# Altium schematic sheet TMC2208.SchDoc
size B
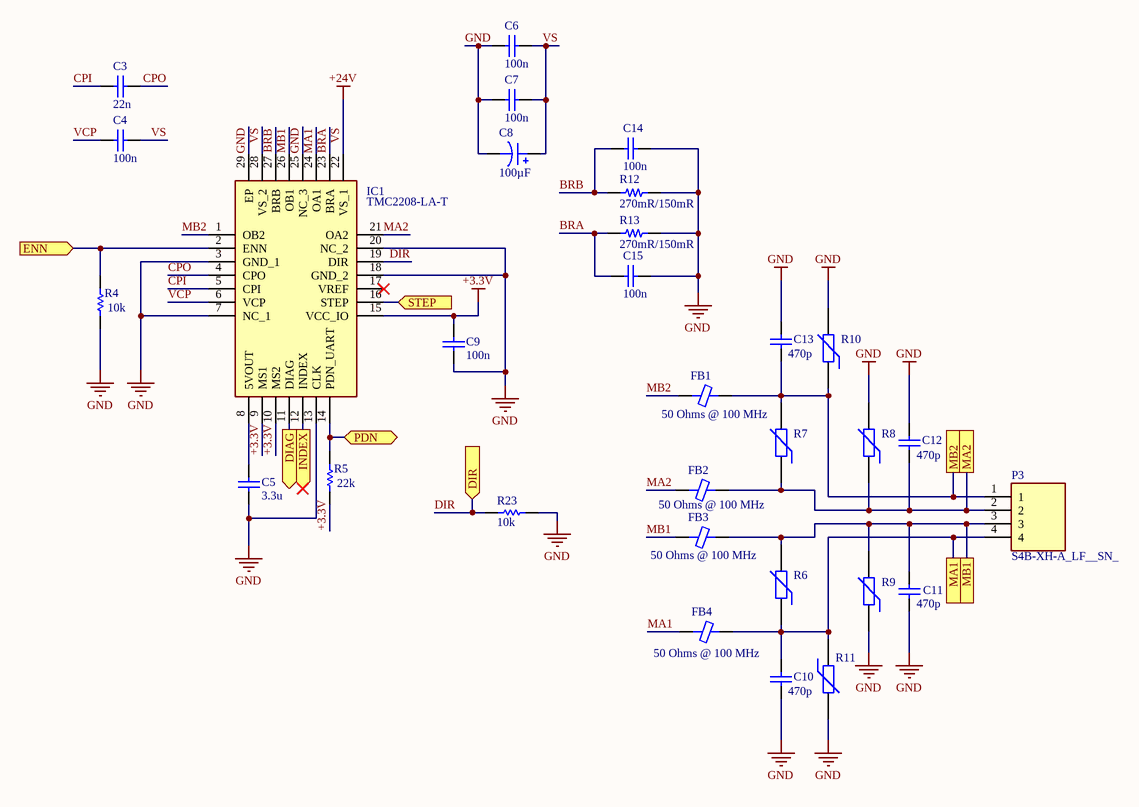
[diagram p0: TMC2208.SchDoc]

## Parts
C3  value 22n  [RAD-0.3]  (hidden comment: Cap)
C4  value 100n  [RAD-0.3]  (hidden comment: Cap)
C5  value 3.3u  [RAD-0.3]  (hidden comment: Cap)
C6  value 100n  [RAD-0.3]  (hidden comment: Cap)
C7  value 100n  [RAD-0.3]  (hidden comment: Cap)
C8  100µF  [CAP ALSMD 8.3MM H10.5MM]
C9  value 100n  [RAD-0.3]  (hidden comment: Cap)
C10  value 470p  [RAD-0.3]  (hidden comment: Cap)
C11  value 470p  [RAD-0.3]  (hidden comment: Cap)
C12  value 470p  [RAD-0.3]  (hidden comment: Cap)
C13  value 470p  [RAD-0.3]  (hidden comment: Cap)
C14  value 100n  [RAD-0.3]  (hidden comment: Cap)
C15  value 100n  [RAD-0.3]  (hidden comment: Cap)
FB1  50 Ohms @ 100 MHz  [FER 1206_3216]
FB2  50 Ohms @ 100 MHz  [FER 1206_3216]
FB3  50 Ohms @ 100 MHz  [FER 1206_3216]
FB4  50 Ohms @ 100 MHz  [FER 1206_3216]
IC1  TMC2208-LA-T  [QFN50P500X500X90-29N-D]
P3  S4B-XH-A_LF__SN_  [SHDRRA4W64P0X250_1X4_1240X1150X700P]
R4  value 10k  [AXIAL-0.3]  (hidden comment: Res1)
R5  value 22k  [AXIAL-0.3]  (hidden comment: Res1)
R6  Res Varistor  [6-0805_N]  (value not drawn)
R7  Res Varistor  [6-0805_N]  (value not drawn)
R8  Res Varistor  [6-0805_N]  (value not drawn)
R9  Res Varistor  [6-0805_N]  (value not drawn)
R10  Res Varistor  [6-0805_N]  (value not drawn)
R11  Res Varistor  [6-0805_N]  (value not drawn)
R12  270mR/150mR  [RES 2512_6432]
R13  270mR/150mR  [RES 2512_6432]
R23  value 10k  [AXIAL-0.3]  (hidden comment: Res1)

## Ports
DIAG (out), DIR (in), ENN (in), INDEX (out), MA1, MA2, MB1, MB2, PDN (bidir), STEP (in)

## Nets
+3.3V: C9.1 IC1.9(MS1) IC1.10(MS2) IC1.15(VCC_IO) R5.1
GND: C5.2 C6.2 C7.2 C8.2 C9.2 C10.1 C11.1 C12.2 C13.2 C14.1 C15.1 IC1.3(GND_1) IC1.7(NC_1) IC1.13(CLK) IC1.18(GND_2) IC1.20(NC_2) IC1.25(NC_3) IC1.29(EP) R4.1 R8.2 R9.1 R10.2 R11.2 R12.1 R13.1 R23.2
VS: C4.1 C6.1 C7.1 C8.1 IC1.22(VS_1) IC1.28(VS_2)  [also labelled +24V]
BRA: C15.2 IC1.23(BRA) R13.2
BRB: C14.2 IC1.27(BRB) R12.2
CPI: C3.2 IC1.5(CPI)
CPO: C3.1 IC1.4(CPO)
DIAG: IC1.11(DIAG) ; port DIAG
DIR: IC1.19(DIR) R23.1 ; port DIR
ENN: IC1.2(ENN) R4.2 ; port ENN
INDEX: IC1.12(INDEX) ; port INDEX
MA1: FB4.1 IC1.24(OA1)
MA1: C10.2 FB4.2 P3.4 R6.1 R11.1 ; port MA1  [a separate net that carries the same name]
MA2: FB2.1 IC1.21(OA2)
MA2: C12.1 FB2.2 P3.2 R7.1 R8.1 ; port MA2  [a separate net that carries the same name]
MB1: FB3.1 IC1.26(OB1)
MB1: C11.2 FB3.2 P3.3 R6.2 R9.2 ; port MB1  [a separate net that carries the same name]
MB2: FB1.1 IC1.1(OB2)
MB2: C13.1 FB1.2 P3.1 R7.2 R10.1 ; port MB2  [a separate net that carries the same name]
PDN: IC1.14(PDN_UART) R5.2 ; port PDN
STEP: IC1.16(STEP) ; port STEP
VCP: C4.2 IC1.6(VCP)
NetC5_1: C5.1 IC1.8(5VOUT)

Not connected (* = marked no-connect by the designer): IC1 17(VREF)*

## Notes on the sheet
- Shortest possible loop
- Shortest path to GND, Isolated from each other
- (near R5) Short wire

## Library data of the parts
C3-C7 C9-C15 = Cap: Capacitor; Published: 8-Jun-2000; LatestRevisionDate: 17-Jul-2002; LatestRevisionNote: Re-released for DXP Platform.; PackageReference: RAD-0.3; Publisher: Altium Limited; PackageDescription: Radial Cap, Thru-Hole; 2 Leads; 0.3 in Pin Spacing
C8 = UUX1V101MNL6GS: CAP ALUM 100UF 20% 35V SMD; manufacturer: Nichicon; Lifetime @ Temp.: 2000 Hrs @ 105°C; Polarization: Polar; Ripple Current @ High Frequency: 367.9mA @ 10kHz; Ripple Current @ Low Frequency: 283mA @ 120Hz; Surface Mount Land Size: 0.327" L x 0.327" W (8.30mm x 8.30mm); Part Number: UUX1V101MNL6GS; Applications: General Purpose; Capacitance: 100µF; componentlink1description: Datasheet; componentlink1url: http://nichicon-us.com/english/products/pdfs/e-uux.pdf; componentlink2description: DigiKey Link; componentlink2url: http://digikey.com/product-detail/en/nichicon/UUX1V101MNL6GS/493-6276-1-ND/3438789; Device Package: Radial, Can - SMD; Height - Seated (Max): 0.413" (10.50mm); lastupdated: 02.09.2020 01:25:15; Lifecycle Status: Active; Minimum Order: 1; Mounting Type: Surface Mount; Operating Temperature: -55°C ~ 105°C; Package / Case: Radial, Can - SMD; packaging: TapeAndReel; partid: 7565; Part Status: Active; price: 0.19; series: UUX; Size / Dimension: 0.315" Dia (8.00mm); Supplier 1: DigiKey; Supplier Part Number 1: 493-6276-1-ND; Tolerance: ±20%; value: 100µF; Voltage - Rated: 35V
FB1-FB4 = ILHB1206ER500V: FERRITE BEAD 50 OHM 1206 1LN; Manufacturer: Vishay Dale; Current Rating (Max): 6A; DC Resistance (DCR) (Max): 20mOhm; Number of Lines: 1; Part Number: ILHB1206ER500V; ComponentLink1Description: Datasheet; ComponentLink1URL: http://www.vishay.com/docs/34102/ilhb.pdf; ComponentLink2Description: DigiKey Link; ComponentLink2URL: https://www.digikey.com/en/products/detail/vishay-dale/ILHB1206ER500V/2575024; Device Package: 1206 (3216 Metric); Height (Max): 0.051" (1.30mm); Impedance @ Frequency: 50 Ohms @ 100 MHz; LastUpdated: 31.07.2022 00:06:55; Lifecycle Status: Active; Minimum Order: 1; Mounting Type: Surface Mount; Operating Temperature: -55°C ~ 125°C; Package / Case: 1206 (3216 Metric); Packaging: TapeAndReel; PartId: 1687; Part Status: Active; Price: 0.06; Series: ILHB; Size / Dimension: 0.126" L x 0.063" W (3.20mm x 1.60mm); Supplier 1: DigiKey; Supplier Part Number 1: 541-2606-1-ND; Value: 50 Ohms @ 100 MHz
IC1 = TMC2208-LA-T: Integrated Circuit; Manufacturer_Name: TRINAMIC; Datasheet Link: https://datasheet.datasheetarchive.com/originals/distributors/DKDS-23/450911.pdf; Height: 0.9mm; Manufacturer_Part_Number: TMC2208-LA-T; Mouser Part Number: 700-TMC2208-LA-T; Mouser Price/Stock: https://www.mouser.co.uk/ProductDetail/Trinamic/TMC2208-LA-T?qs=TiOZkKH1s2TUCbyrI5xF3A%3D%3D
P3 = S4B-XH-A_LF__SN_: Connector; Manufacturer_Name: JST (JAPAN SOLDERLESS TERMINALS); Manufacturer_Part_Number: S4B-XH-A(LF)(SN); Datasheet Link: http://www.jst-mfg.com/product/pdf/eng/eXH.pdf; Height: 7mm; Arrow Part Number: S4B-XH-A(LF)(SN); Arrow Price/Stock: https://www.arrow.com/en/products/s4b-xh-a-lf-sn/jst-manufacturing
R4 R5 R23 = Res1: Resistor; Published: 8-Jun-2000; LatestRevisionDate: 17-Jul-2002; LatestRevisionNote: Re-released for DXP Platform.; PackageReference: AXIAL-0.3; Publisher: Altium Limited; PackageDescription: Axial Device, Thru-Hole; 2 Leads; 0.3 in Pin Spacing
R6-R11 = Res Varistor: Varistor (Voltage-Sensitive Resistor); Published: 24-Mar-1999; LatestRevisionDate: 29-May-2009; LatestRevisionNote: IPC-7351 Footprint Added.; PackageVersion: Mar-2003; PackageReference: 6-0805; Publisher: Altium Limited; PackageDescription: Chip Resistor 0805 Case Size; Code_IPC: RESC2012
R12 R13 = RL73H3AR27FTDF: RES 0.27 OHM 1% 1W 2512; Manufacturer: TE Connectivity Passive Product; Resistance: 270 mOhms; Temperature Coefficient: ±100ppm/°C; Value: 270 mOhms; Part Number: RL73H3AR27FTDF; ComponentLink1Description: Datasheet; ComponentLink1URL: https://www.te.com/commerce/DocumentDelivery/DDEController?Action=srchrtrv&DocNm=1773269&DocType=DS&DocLang=English; ComponentLink2Description: DigiKey Link; ComponentLink2URL: http://digikey.com/product-detail/en/te-connectivity-passive-product/RL73H3AR27FTDF/A138622CT-ND/9372023; Composition: Thick Film; Device Package: 2512 (6432 Metric); Features: Current Sense; Height - Seated (Max): 0.028" (0.70mm); LastUpdated: 02.09.2020 01:26:50; Lifecycle Status: Active; Minimum Order: 1; Number of Terminations: 2; Operating Temperature: -55°C ~ 155°C; Package / Case: 2512 (6432 Metric); Packaging: TapeAndReel; Part Status: Active; Power (Watts): 1W; Price: 0.19; Series: RL73, CGS; Size / Dimension: 0.250" L x 0.122" W (6.35mm x 3.10mm); Supplier 1: DigiKey; Supplier Part Number 1: A138622CT-ND; Supplier Device Package: 2512; Tolerance: ±1%